# Altium schematic sheet MCU.SchDoc
size A4
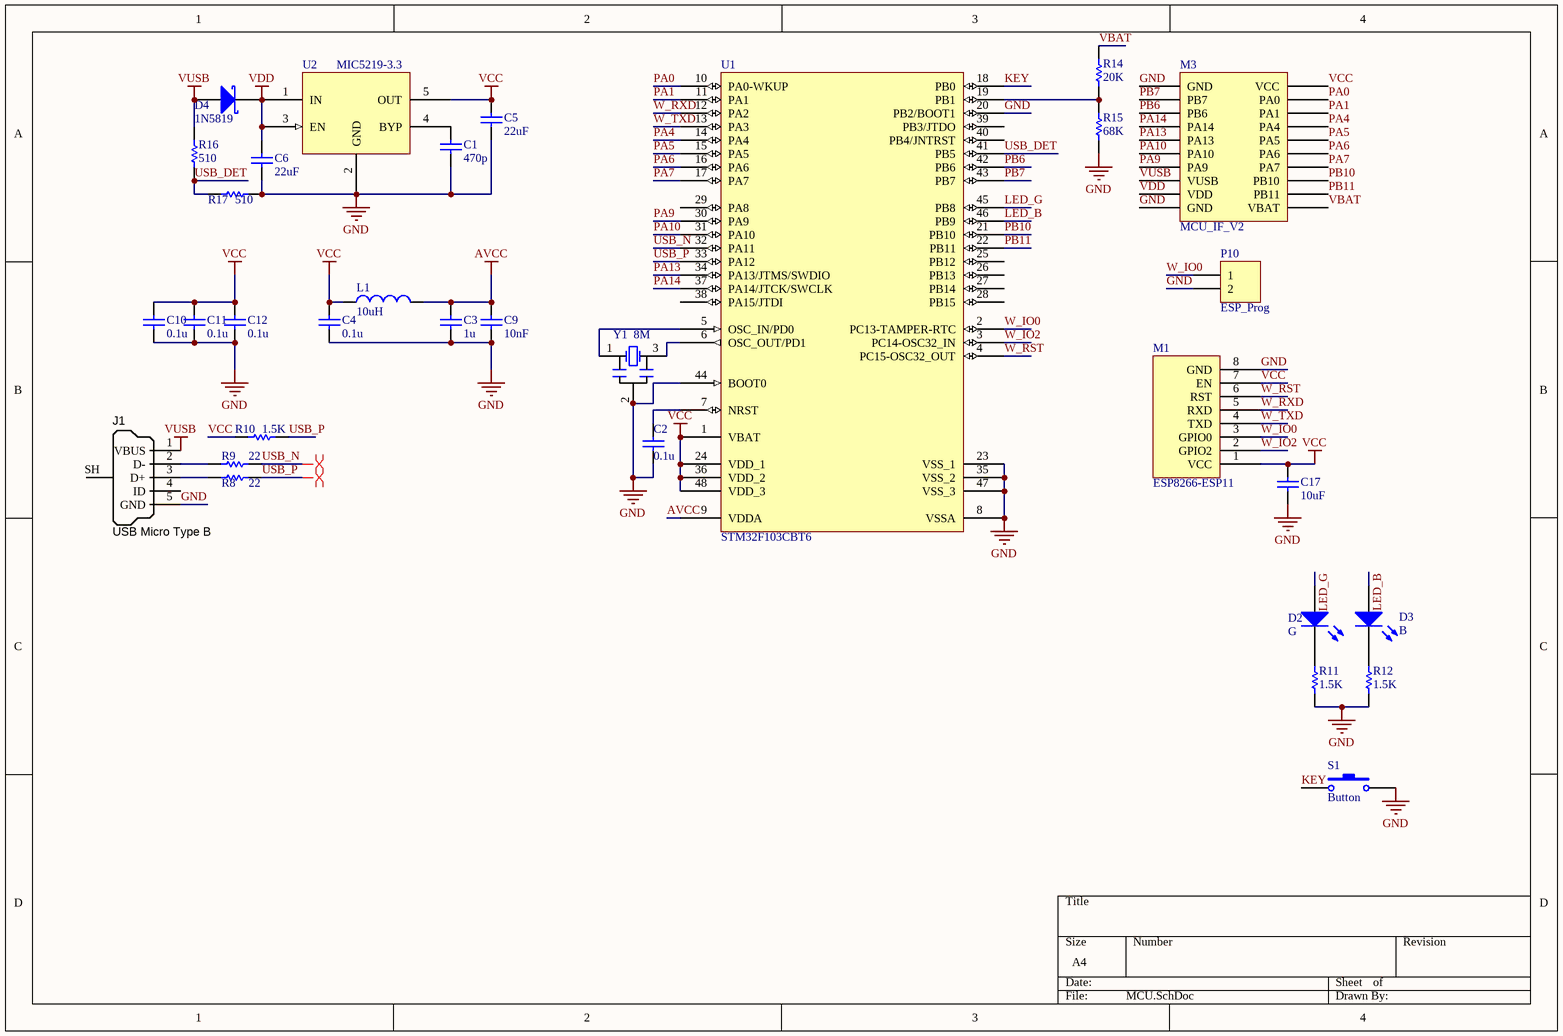
[diagram p0: MCU.SchDoc]

## Parts
C1  value 470p  [C-1608[0603]]  (hidden comment: Cap Semi)
C2  value 0.1u  [C-1608[0603]]  (hidden comment: Cap Semi)
C3  value 1u  [C-1608[0603]]  (hidden comment: Cap Semi)
C4  value 0.1u  [C-1608[0603]]  (hidden comment: Cap Semi)
C5  value 22uF  [C-2012[0805]]  (hidden comment: Cap Semi)
C6  value 22uF  [C-2012[0805]]  (hidden comment: Cap Semi)
C9  value 10nF  [C-1608[0603]]  (hidden comment: Cap Semi)
C10  value 0.1u  [C-1608[0603]]  (hidden comment: Cap Semi)
C11  value 0.1u  [C-1608[0603]]  (hidden comment: Cap Semi)
C12  value 0.1u  [C-1608[0603]]  (hidden comment: Cap Semi)
C17  value 10uF  [C-1608[0603]]  (hidden comment: Cap Semi)
D2  G  [LED-1608[0603]-G]
D3  B  [LED-1608[0603]-B]
D4  1N5819  [SOD123]
J1  USB Micro Type B  [MICRO USB 3D]
L1  value 10uH  [L-1608[0603]]  (hidden comment: Inductor)
M1  ESP8266-ESP11  [ESP8266-ESP11]
M3  MCU_IF_V2  [MCU_IF_V2]
P10  ESP_Prog  [EDGE_1]
R8  value 22  [R-1608[0603]]  (hidden comment: Res Semi)
R9  value 22  [R-1608[0603]]  (hidden comment: Res Semi)
R10  value 1.5K  [R-1608[0603]]  (hidden comment: Res Semi)
R11  value 1.5K  [R-1608[0603]]  (hidden comment: Res Semi)
R12  value 1.5K  [R-1608[0603]]  (hidden comment: Res Semi)
R14  value 20K  [R-1608[0603]]  (hidden comment: Res Semi)
R15  value 68K  [R-1608[0603]]  (hidden comment: Res Semi)
R16  value 510  [R-1608[0603]]  (hidden comment: Res Semi)
R17  value 510  [R-1608[0603]]  (hidden comment: Res Semi)
S1  Button  [SW-2pin-SMD]
U1  STM32F103CBT6  [LQFP48_N]
U2  MIC5219-3.3  [SOT23-5]
Y1  8M  [Crystal_C]

## Nets
AVCC: C3.2 C9.2 L1.2 U1.9(VDDA)
GND: C1.2 C2.1 C3.1 C4.1 C5.2 C6.2 C9.1 C10.1 C11.1 C12.1 C17.1 J1.5(GND) M1.8(GND) M3.1(GND) M3.10(GND) P10.2 R11.2 R12.2 R15.2 R17.1 S1.2 U1.8(VSSA) U1.20(PB2/BOOT1) U1.23(VSS_1) U1.35(VSS_2) U1.44(BOOT0) U1.47(VSS_3) U2.2(GND) Y1.2(GND)
VCC: C4.2 C5.1 C10.2 C11.2 C12.2 C17.2 L1.1 M1.1(VCC) M1.7(EN) M3.20(VCC) R10.2 U1.1(VBAT) U1.24(VDD_1) U1.36(VDD_2) U1.48(VDD_3) U2.5(OUT)
VDD: C6.1 D4.2(K) M3.9(VDD) U2.1(IN) U2.3(EN)
VUSB: D4.1(A) J1.1(VBUS) M3.8(VUSB) R16.2
KEY: S1.1 U1.18(PB0)
LED_B: D3.1(A) U1.46(PB9)
LED_G: D2.1(A) U1.45(PB8)
PA0: M3.19(PA0) U1.10(PA0-WKUP)
PA1: M3.18(PA1) U1.11(PA1)
PA4: M3.17(PA4) U1.14(PA4)
PA5: M3.16(PA5) U1.15(PA5)
PA6: M3.15(PA6) U1.16(PA6)
PA7: M3.14(PA7) U1.17(PA7)
PA9: M3.7(PA9) U1.30(PA9)
PA10: M3.6(PA10) U1.31(PA10)
PA13: M3.5(PA13) U1.34(PA13/JTMS/SWDIO)
PA14: M3.4(PA14) U1.37(PA14/JTCK/SWCLK)
PB6: M3.3(PB6) U1.42(PB6)
PB7: M3.2(PB7) U1.43(PB7)
PB10: M3.13(PB10) U1.21(PB10)
PB11: M3.12(PB11) U1.22(PB11)
USB_DET: R16.1 R17.2 U1.41(PB5)
USB_N: R9.2 U1.32(PA11)
USB_P: R8.2 R10.1 U1.33(PA12)
VBAT: M3.11(VBAT) R14.2
W_IO0: M1.3(GPIO0) P10.1 U1.2(PC13-TAMPER-RTC)
W_IO2: M1.2(GPIO2) U1.3(PC14-OSC32_IN)
W_RST: M1.6(RST) U1.4(PC15-OSC32_OUT)
W_RXD: M1.5(RXD) U1.12(PA2)
W_TXD: M1.4(TXD) U1.13(PA3)
NetC1_1: C1.1 U2.4(BYP)
NetC2_2: C2.2 U1.7(NRST)
NetD2_2: D2.2(K) R11.1
NetD3_2: D3.2(K) R12.1
NetJ1_2: J1.2(D-) R9.1
NetJ1_3: J1.3(D+) R8.1
NetR14_1: R14.1 R15.1 U1.19(PB1)
NetU1_5: U1.5(OSC_IN/PD0) Y1.1(OSC1)
NetU1_6: U1.6(OSC_OUT/PD1) Y1.3(OSC2)

Not connected (* = marked no-connect by the designer): J1 4(ID) SH(Shell); U1 25(PB12) 26(PB13) 27(PB14) 28(PB15) 29(PA8) 38(PA15/JTDI) 39(PB3/JTDO) 40(PB4/JNTRST)

## Layout directives
differential pair: USB_N, USB_P

## Library data of the parts
C1-C6 C9-C12 C17 = Cap Semi: Capacitor (Semiconductor SIM Model); Published: 8-Jun-2000; PackageReference: C1206; Publisher: Altium Limited
  C1 C5 C6: LatestRevisionDate: 29-May-2009; LatestRevisionNote: IPC-7351 Footprint Added.; PackageDescription: Chip Capacitor
  C2-C4 C9-C12 C17: LatestRevisionDate: 17-Jul-2002; LatestRevisionNote: Re-released for DXP Platform.
D2 = LED2: Green LED; Published: 8-Jun-2000; LatestRevisionDate: 17-Jul-2002; LatestRevisionNote: Re-released for DXP Platform.; PackageDocument: Feb-2002; PackageReference: 3.2X1.6X1.1; Publisher: Altium Limited
D3 = LED2: Blue LED; Published: 8-Jun-2000; LatestRevisionDate: 17-Jul-2002; LatestRevisionNote: Re-released for DXP Platform.; PackageDocument: Feb-2002; PackageReference: 3.2X1.6X1.1; Publisher: Altium Limited
D4 = D Schottky: Schottky Diode; Published: 8-Jun-2000; LatestRevisionDate: 17-Jul-2002; LatestRevisionNote: Re-released for DXP Platform.; Publisher: Altium Limited
J1 = USB_Micro_TypeB: Connector SMD USB Micro Type B middle mount; Manufacturer 1: Molex Inc; Manufacturer Part Number 1: 47491-0001; SCDType: undef; Package / Case: SMD; Supplier 1: Digi-Key; Supplier Part Number 1: WM17142CT-ND
L1 = Inductor: Code_IEC: 1005; Published: 8-Jun-2000; LatestRevisionDate: 17-Jul-2002; LatestRevisionNote: Re-released for DXP Platform.; PackageReference: 0402-A; Publisher: Altium Limited; Code_JEITA: 0402
M3 = MCU_IF_V1
P10 = Header 2: Header, 2-Pin; LatestRevisionDate: 17-Jul-2002; LatestRevisionNote: Re-released for DXP Platform.; Publisher: Altium Limited
R8-R12 R14-R17 = Res Semi: Semiconductor Resistor; Published: 8-Jun-2000; LatestRevisionDate: 17-Jul-2002; LatestRevisionNote: Re-released for DXP Platform.; PackageReference: AXIAL-0.5; Publisher: Altium Limited
S1 = SW-PB: Switch; Published: 24-Mar-1999; LatestRevisionDate: 17-Jul-2002; LatestRevisionNote: Re-released for DXP Platform.; PackageReference: SPST-2; Publisher: Altium Limited
U1 = STM32F103CBT6: STM32 ARM-based 32-bit MCU with 128 Kbytes Flash, 48-pin LQFP, Industrial Temperature; Published: 30-May-2008; DatasheetVersion: rev6, Mar-2008; PackageVersion: Mar-2008; PackageReference: LQFP48; Publisher: Altium Limited; PackageDescription: 48-Pin Low-Profile Quad Flat Pack, 7 x 7 mm Body, 0.5 mm Pitch (LQFP48); ComponentLink1Description: Manufacturer Link; ComponentLink1URL: www.st.com/stm32; ComponentLink2Description: Datasheet; ComponentLink2URL: http://www.st.com/stonline/products/literature/ds/13587.pdf
U2 = MIC5219: 500mA-Peak Output LDO Regulator
Y1 = XTAL_C: Crystal Oscillator; Published: 8-Jun-2000; LatestRevisionDate: 17-Jul-2002; LatestRevisionNote: Re-released for DXP Platform.; PackageReference: R38; Publisher: Altium Limited
M1 = ESP8266-ESP11: Value: http://item.taobao.com/item.htm?id=41802488823